# EAGLE design board (EAGLE 9.2.2)
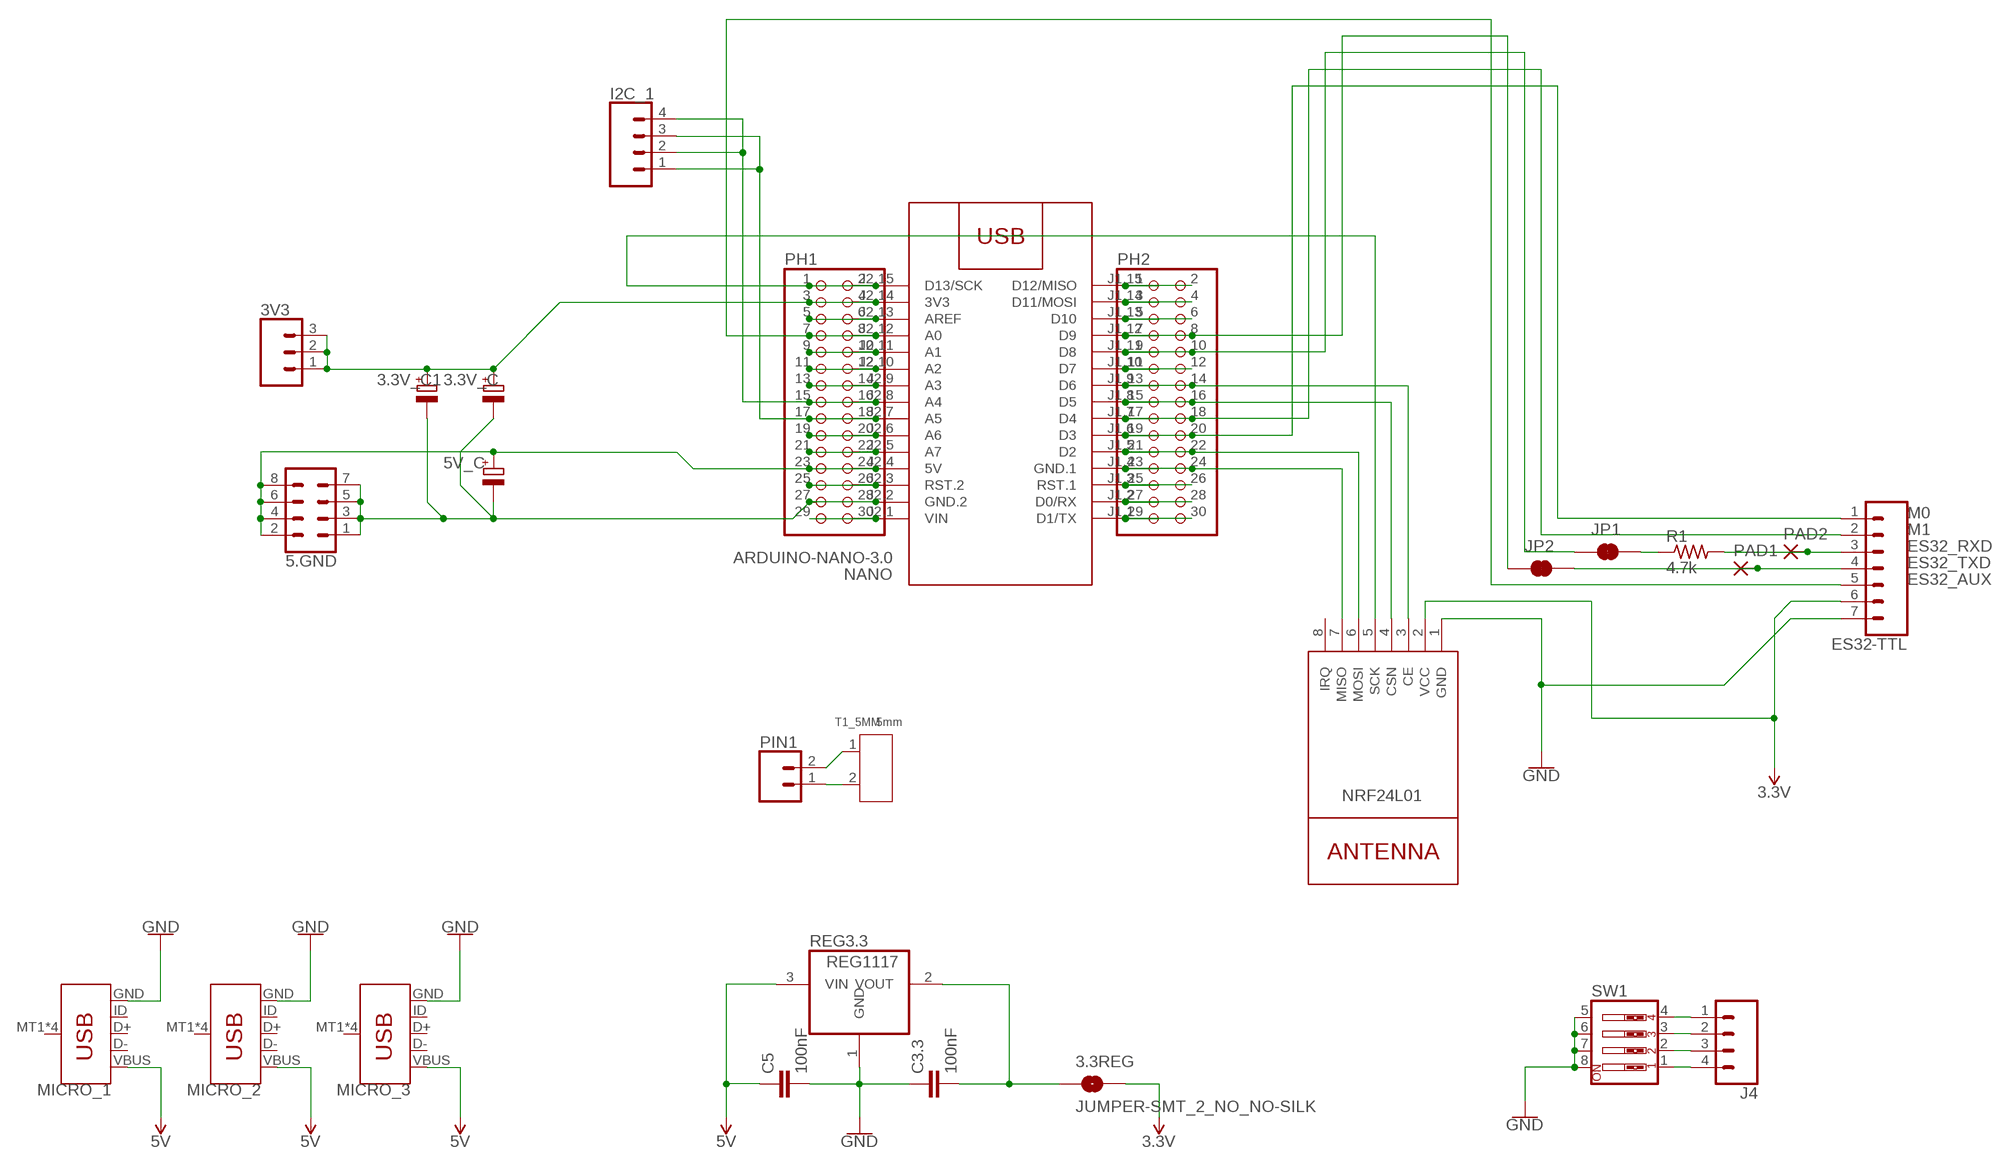
[diagram p0: schematic, sheet 1]

## Parts
3.3REG  JUMPER-SMT_2_NO_NO-SILK  [SMT-JUMPER_2_NO_NO-SILK]
3.3V_C  CPOL-EUD  [PANASONIC_D]
3.3V_C1  CPOL-EUD  [PANASONIC_D]
3V3  CONN_03LOCK  [1X03_LOCK]
5.GND  CONN_04X2  [2X4]
5V_C  CPOL-EUD  [PANASONIC_D]
C3.3  100nF  C-EUC0805  [C0805]
C5  100nF  C-EUC0805  [C0805]
ES32-TTL  CONN_07LOCK  [1X07_LOCK]
I2C_1  CONN_04LOCK  [1X04_LOCK]
J4  CONN_04LOCK  [1X04_LOCK]
JP1  JUMPER-SMT_2_NC_TRACE_SILK  [SMT-JUMPER_2_NC_TRACE_SILK]
JP2  JUMPER-SMT_2_NC_TRACE_SILK  [SMT-JUMPER_2_NC_TRACE_SILK]
MICRO_1  USB_MICRO-B_SMT  [USB-MICROB]
MICRO_2  USB_MICRO-B_SMT  [USB-MICROB]
MICRO_3  USB_MICRO-B_SMT  [USB-MICROB]
NANO  ARDUINO-NANO-3.0  [ARDUINO-NANO-3.0]
NRF24L01  WIRELESS-NRF24L01  [WIRELESS-NRF24L01]
PAD1  1,6/0,8  [1,6/0,8]
PAD2  1,6/0,8  [1,6/0,8]
PH1  PINHD-2X15  [2X15]
PH2  PINHD-2X15  [2X15]
PIN1  CONN_02LOCK  [1X02_LOCK]
R1  4.7k  R-US_R2012  [R2012]
REG3.3  REG1117  [SOT223]
SW1  SW_DIP-4  [EDG-04]
T1_5MM  5mm  SCREW-TERMINAL-GREEN(2P-5.0)  [H2-5.0-10.5X8.0MM]

## Nets
3.3V [power]: 3.3REG.2 3.3V_C1.+ 3.3V_C.+ 3V3.1 3V3.2 3V3.3 ES32-TTL.6 NANO.J2.14(3V3) NRF24L01.2(VCC) PH1.3 PH1.4
5V [power]: 5.GND.2 5.GND.4 5.GND.6 5.GND.8 5V_C.+ C5.1 MICRO_1.VBUS MICRO_2.VBUS MICRO_3.VBUS NANO.J2.4(5V) PH1.23 PH1.24 REG3.3.3(VIN)
A6: NANO.J2.6(A6) PH1.19 PH1.20
A7: NANO.J2.5(A7) PH1.21 PH1.22
CE_NRF: NANO.J1.9(D6) NRF24L01.3(CE) PH2.13 PH2.14
CSN_NRF: NANO.J1.8(D5) NRF24L01.4(CSN) PH2.15 PH2.16
ES32_AUX: ES32-TTL.5 NANO.J2.12(A0) PH1.7 PH1.8
ES32_RXD: ES32-TTL.3 PAD2.1(P) R1.2
ES32_TXD: JP2.1 NANO.J1.12(D9) PH2.7 PH2.8
GND [power]: 3.3V_C1.- 3.3V_C.- 5.GND.1 5.GND.3 5.GND.5 5.GND.7 5V_C.- C3.3.1 C5.2 ES32-TTL.7 MICRO_1.GND MICRO_2.GND MICRO_3.GND NANO.J2.2(GND.2) NRF24L01.1(GND) PH1.27 PH1.28 REG3.3.1(GND) SW1.5 SW1.6 SW1.7 SW1.8
M0: ES32-TTL.1 NANO.J1.6(D3) PH2.19 PH2.20
M1: ES32-TTL.2 NANO.J1.7(D4) PH2.17 PH2.18
MISO_NRF: NANO.J1.4(GND.1) NRF24L01.7(MISO) PH2.23 PH2.24
MOSI_NRF: NANO.J1.5(D2) NRF24L01.6(MOSI) PH2.21 PH2.22
N$1: NANO.J1.14(D11/MOSI) PH2.3 PH2.4
N$2 [power]: 3.3REG.1 C3.3.2 REG3.3.2(VOUT)
N$3: NANO.J2.13(AREF) PH1.5 PH1.6
N$4: NANO.J1.13(D10) PH2.5 PH2.6
N$5: NANO.J2.11(A1) PH1.9 PH1.10
N$6: NANO.J2.10(A2) PH1.11 PH1.12
N$7: NANO.J2.9(A3) PH1.13 PH1.14
N$8: JP1.2 R1.1
N$9: ES32-TTL.4 JP2.2 PAD1.1(P)
N$16: NANO.J1.15(D12/MISO) PH2.1 PH2.2
N$17: JP1.1 NANO.J1.11(D8) PH2.9 PH2.10
N$21: NANO.J1.10(D7) PH2.11 PH2.12
N$23 [terminal]: PIN1.2 T1_5MM.1
N$26 [terminal]: PIN1.1 T1_5MM.2
N$28: NANO.J1.3(RST.1) PH2.25 PH2.26
N$29: NANO.J1.2(D0/RX) PH2.27 PH2.28
N$30: NANO.J1.1(D1/TX) PH2.29 PH2.30
N$39 [power]: J4.1 SW1.4
N$40 [power]: J4.2 SW1.3
N$41 [power]: J4.3 SW1.2
N$42 [power]: J4.4 SW1.1
RST: NANO.J2.3(RST.2) PH1.25 PH1.26
SCK_NRF: NANO.J2.15(D13/SCK) NRF24L01.5(SCK) PH1.1 PH1.2
SCL: I2C_1.1 I2C_1.3 NANO.J2.7(A5) PH1.17 PH1.18
SDA: I2C_1.2 I2C_1.4 NANO.J2.8(A4) PH1.15 PH1.16
VIN [power]: NANO.J2.1(VIN) PH1.29 PH1.30
Unconnected: MICRO_1.D+ MICRO_1.D- MICRO_1.ID MICRO_1.MT1(SHIELD) MICRO_1.MT2(SHIELD) MICRO_1.P$1(SHIELD) MICRO_1.P$2(SHIELD) MICRO_2.D+ MICRO_2.D- MICRO_2.ID MICRO_2.MT1(SHIELD) MICRO_2.MT2(SHIELD) MICRO_2.P$1(SHIELD) MICRO_2.P$2(SHIELD) MICRO_3.D+ MICRO_3.D- MICRO_3.ID MICRO_3.MT1(SHIELD) MICRO_3.MT2(SHIELD) MICRO_3.P$1(SHIELD) MICRO_3.P$2(SHIELD) NRF24L01.8(IRQ)

## Library data of the parts
3.3REG = SparkFun-Jumpers:JUMPER-SMT_2_NO: Normally open jumper This jumper has two pads in close proximity to each other. Apply solder to close the connection. Round pads are easier to solder for beginners, but are a lot larger. SparkFun Product that uses the round pads: SparkFun EL Sequencer <https://www.sparkfun.com/products/12781>
3.3V_C 3.3V_C1 5V_C = rcl:CPOL-EU: POLARIZED CAPACITOR, European symbol
3V3 = SparkFun-Connectors:CONN_03: Multi connection point. Often used as Generic Header-pin footprint for 0.1 inch spaced/style header connections On any of the 0.1 inch spaced packages, you can populate with these: Break Away Headers - Straight <https://www.sparkfun.com/products/116> (PRT-00116) Break Away Male Headers - Right Angle <https://www.sparkfun.com/products/553> (PRT-00553) Female Headers <https://www.sparkfun.com/products/115> (PRT-00115) Break Away Headers - Machine Pin <https://www.sparkfun.com/products/117> (PRT-00117) Break Away Female Headers - Swiss Machine Pin <https://www.sparkfun.com/products/743> (PRT-00743) Stackable Header - 3 Pin (Female, 0.1") <https://www.sparkfun.com/products/13875> (PRT-13875) For SCREWTERMINALS and SPRING TERMINALS visit here: Screw Terimnals on SparkFun.com <https://www.sparkfun.com/search/results?term=Screw+Terminals> (5mm/3.5mm/2.54mm spacing) This device is also useful as a general connection point to wire up your design to another part of your project. Our various solder wires solder well into these plated through hole pads. Hook-Up Wire - Assortment (Stranded, 22 AWG) <https://www.sparkfun.com/products/11375> (PRT-11375) Hook-Up Wire - Assortment (Solid Core, 22 AWG) <https://www.sparkfun.com/products/11367> (PRT-11367) View the entire wire category on our website here <https://www.sparkfun.com/categories/141> Special notes: Molex polarized connector foot print use with SKU : PRT-08232 with associated crimp pins and housings.
5.GND = SparkFun-Connectors:CONN_04X2: Multi connection point. Often used as Generic Header-pin footprint for 0.1 inch spaced/style header connections On any of the 0.1 inch spaced packages, you can populate with these: Break Away Headers - Straight <https://www.sparkfun.com/products/116> (PRT-00116) Break Away Male Headers - Right Angle <https://www.sparkfun.com/products/553> (PRT-00553) Female Headers <https://www.sparkfun.com/products/115> (PRT-00115) Break Away Headers - Machine Pin <https://www.sparkfun.com/products/117> (PRT-00117) Break Away Female Headers - Swiss Machine Pin <https://www.sparkfun.com/products/743> (PRT-00743)
C3.3 C5 = rcl:C-EU: CAPACITOR, European symbol; SPICEPREFIX: C
ES32-TTL = SparkFun-Connectors:CONN_07: Multi connection point. Often used as Generic Header-pin footprint for 0.1 inch spaced/style header connections On any of the 0.1 inch spaced packages, you can populate with these: Break Away Headers - Straight <https://www.sparkfun.com/products/116> (PRT-00116) Break Away Male Headers - Right Angle <https://www.sparkfun.com/products/553> (PRT-00553) Female Headers <https://www.sparkfun.com/products/115> (PRT-00115) Break Away Headers - Machine Pin <https://www.sparkfun.com/products/117> (PRT-00117) Break Away Female Headers - Swiss Machine Pin <https://www.sparkfun.com/products/743> (PRT-00743) For SCREWTERMINALS and SPRING TERMINALS visit here: Screw Terimnals on SparkFun.com <https://www.sparkfun.com/search/results?term=Screw+Terminals> (5mm/3.5mm/2.54mm spacing) This device is also useful as a general connection point to wire up your design to another part of your project. Our various solder wires solder well into these plated through hole pads. Hook-Up Wire - Assortment (Stranded, 22 AWG) <https://www.sparkfun.com/products/11375> (PRT-11375) Hook-Up Wire - Assortment (Solid Core, 22 AWG) <https://www.sparkfun.com/products/11367> (PRT-11367) View the entire wire category on our website here <https://www.sparkfun.com/categories/141> Special notes: Molex polarized connector foot print use with SKU : PRT-08231 with associated crimp pins and housings. 1MM SMD Version SKU: PRT-10208 NOTES ON THE VARIANTS LOCK and LOCK_LONGPADS... This footprint was designed to help hold the alignment of a through-hole component (i.e. 6-pin header) while soldering it into place. You may notice that each hole has been shifted either up or down by 0.005 of an inch from it's more standard position (which is a perfectly straight line). This slight alteration caused the pins (the squares in the middle) to touch the edges of the holes. Because they are alternating, it causes a "brace" to hold the component in place. 0.005 has proven to be the perfect amount of "off-center" position when using our standard breakaway headers. Although looks a little odd when you look at the bare footprint, once you have a header in there, the alteration is very hard to notice. Also,if you push a header all the way into place, it is covered up entirely on the bottom side.
I2C_1 J4 = SparkFun-Connectors:CONN_04: Multi connection point. Often used as Generic Header-pin footprint for 0.1 inch spaced/style header connections On any of the 0.1 inch spaced packages, you can populate with these: Break Away Headers - Straight <https://www.sparkfun.com/products/116> (PRT-00116) Break Away Male Headers - Right Angle <https://www.sparkfun.com/products/553> (PRT-00553) Female Headers <https://www.sparkfun.com/products/115> (PRT-00115) Break Away Headers - Machine Pin <https://www.sparkfun.com/products/117> (PRT-00117) Break Away Female Headers - Swiss Machine Pin <https://www.sparkfun.com/products/743> (PRT-00743) For SCREWTERMINALS and SPRING TERMINALS visit here: Screw Terimnals on SparkFun.com <https://www.sparkfun.com/search/results?term=Screw+Terminals> (5mm/3.5mm/2.54mm spacing) This device is also useful as a general connection point to wire up your design to another part of your project. Our various solder wires solder well into these plated through hole pads. Hook-Up Wire - Assortment (Stranded, 22 AWG) <https://www.sparkfun.com/products/11375> (PRT-11375) Hook-Up Wire - Assortment (Solid Core, 22 AWG) <https://www.sparkfun.com/products/11367> (PRT-11367) View the entire wire category on our website here <https://www.sparkfun.com/categories/141> Special notes: Molex polarized connector foot print use with SKU : PRT-08231 with associated crimp pins and housings. 1MM SMD Version SKU: PRT-10208; PROD_ID: CONN-09696
JP1 JP2 = SparkFun-Jumpers:JUMPER-SMT_2_NC_TRACE: Normally closed trace jumper This jumper has a trace between two pads so it's normally closed (NC). Use a razor knife to open the connection. For best results follow the IPC guidelines for cutting traces: Cutout at least 0.063 mm (0.005 in). Remove all loose material to clean up the cut area. Seal the cut with an approved epoxy. Reapply solder to reclose the connection.
MICRO_1-MICRO_3 = SparkFun-Connectors:USB_MICRO-B: USB Type Micro-B Connector Male/female and PTH/SMT variants SparkFun Products: SparkFun microB USB Breakout <https://www.sparkfun.com/products/12035> SparkFun USB microB Plug Breakout <https://www.sparkfun.com/products/10031> SparkFun ESP8266 Thing <https://www.sparkfun.com/products/13231>; PROD_ID: CONN-09505; SF_ID: PRT-08533
NANO = diy-modules:ARDUINO-NANO-3.0: Arduino Nano 3.0 and compatible devices More details available here: https://www.arduino.cc/en/Main/ArduinoBoardNano Click here to find device on ebay.com <http://www.ebay.com/sch/arduino+nano>
NRF24L01 = diy-modules:WIRELESS-NRF24L01: 2.4 GHz Wireless Module based on NRF24L01 chip More details available here: http://www.electrodragon.com/w/NRF24L01 Click here to find device on ebay.com <http://www.ebay.com/sch/nrf24l01+arduino>
PAD1 PAD2 = wirepad:1,6/0,8: THROUGH-HOLE PAD
PH1 PH2 = pinhead:PINHD-2X15: PIN HEADER
PIN1 = SparkFun-Connectors:CONN_02: Multi connection point. Often used as Generic Header-pin footprint for 0.1 inch spaced/style header connections On any of the 0.1 inch spaced packages, you can populate with these: Break Away Headers - Straight <https://www.sparkfun.com/products/116> (PRT-00116) Break Away Male Headers - Right Angle <https://www.sparkfun.com/products/553> (PRT-00553) Female Headers <https://www.sparkfun.com/products/115> (PRT-00115) Break Away Headers - Machine Pin <https://www.sparkfun.com/products/117> (PRT-00117) Break Away Female Headers - Swiss Machine Pin <https://www.sparkfun.com/products/743> (PRT-00743) For SCREWTERMINALS and SPRING TERMINALS visit here: Screw Terimnals on SparkFun.com <https://www.sparkfun.com/search/results?term=Screw+Terminals> (5mm/3.5mm/2.54mm spacing) This device is also useful as a general connection point to wire up your design to another part of your project. Our various solder wires solder well into these plated through hole pads. Hook-Up Wire - Assortment (Stranded, 22 AWG) <https://www.sparkfun.com/products/11375> (PRT-11375) Hook-Up Wire - Assortment (Solid Core, 22 AWG) <https://www.sparkfun.com/products/11367> (PRT-11367) View the entire wire category on our website here <https://www.sparkfun.com/categories/141> Special notes: Molex polarized connector foot print use with: PRT-08233 with associated crimp pins and housings. 2.54_SCREWTERM for use with PRT-10571. 3.5mm Screw Terminal footprints for PRT-08084 5mm Screw Terminal footprints for use with PRT-08432
R1 = rcl:R-US_: RESISTOR, American symbol; SPICEPREFIX: R
REG3.3 = burr-brown:REG1117: 800mA and 1A Low Dropout (LDO) Positive Regulator 1.8V, 2.5V, 2.85V, 3.3V, 5V, and Adj; MPN: REG1117; OC_FARNELL: 1097566; OC_NEWARK: 14P6981
SW1 = special:SW_DIP-4: DIP SWITCH
T1_5MM = Seeed-Connector:SCREW-TERMINAL-GREEN(2P-5.0): 320110031; VALUE: GREEN-2P-5.0

## Net classes
0 default: width 0.203 mm
1 power: width 0.762 mm, clearance 0.254 mm
2 terminal: width 2.159 mm, clearance 0.305 mm

## Board
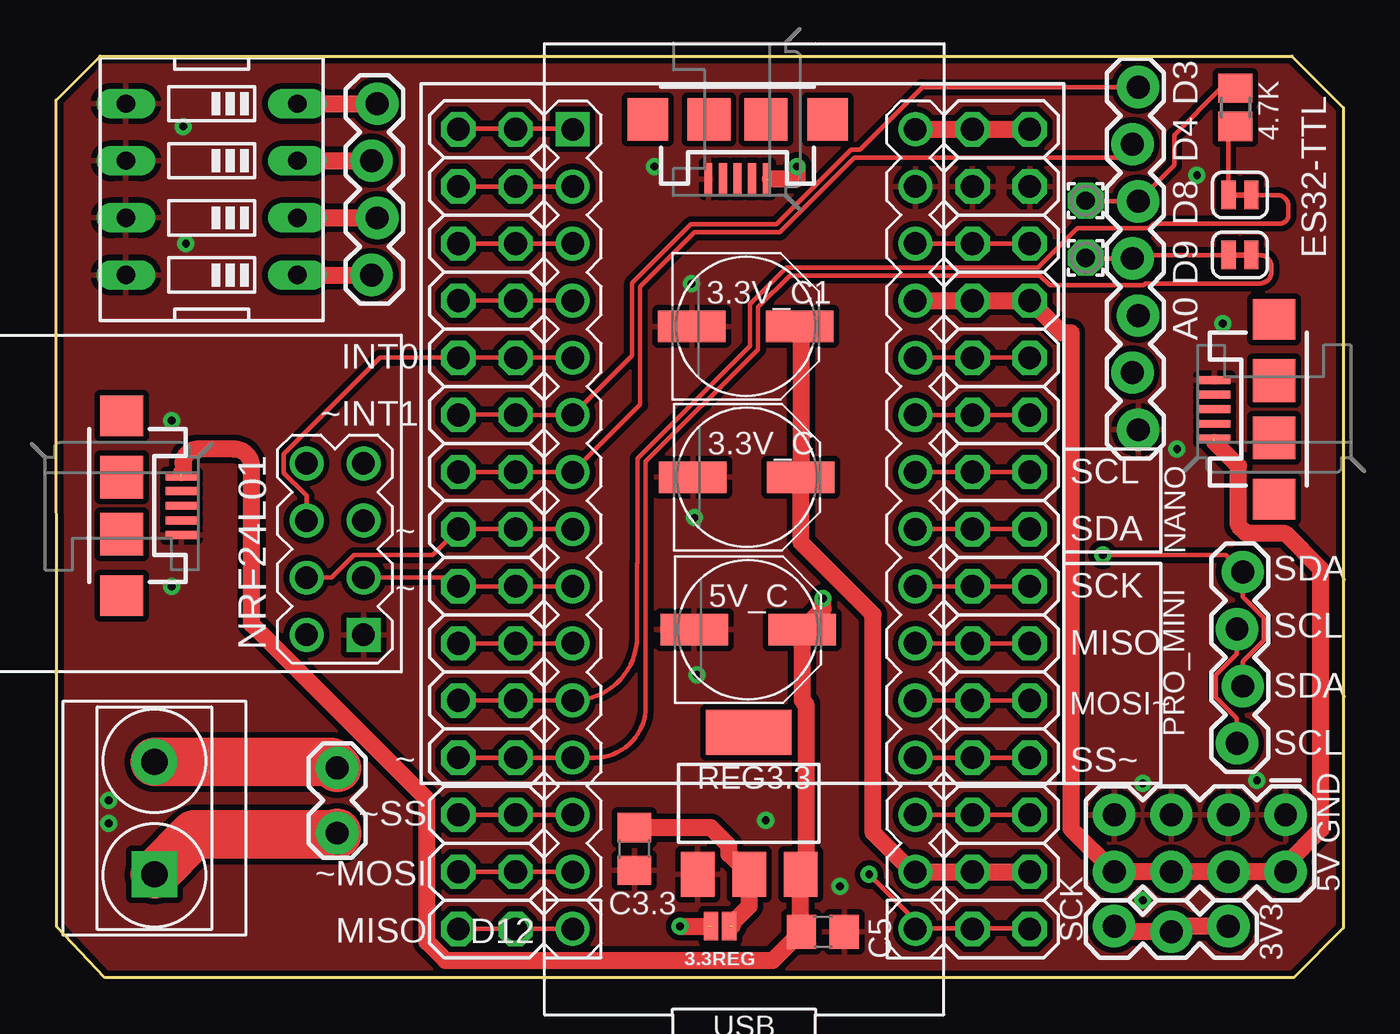
[diagram p1: board, top side]
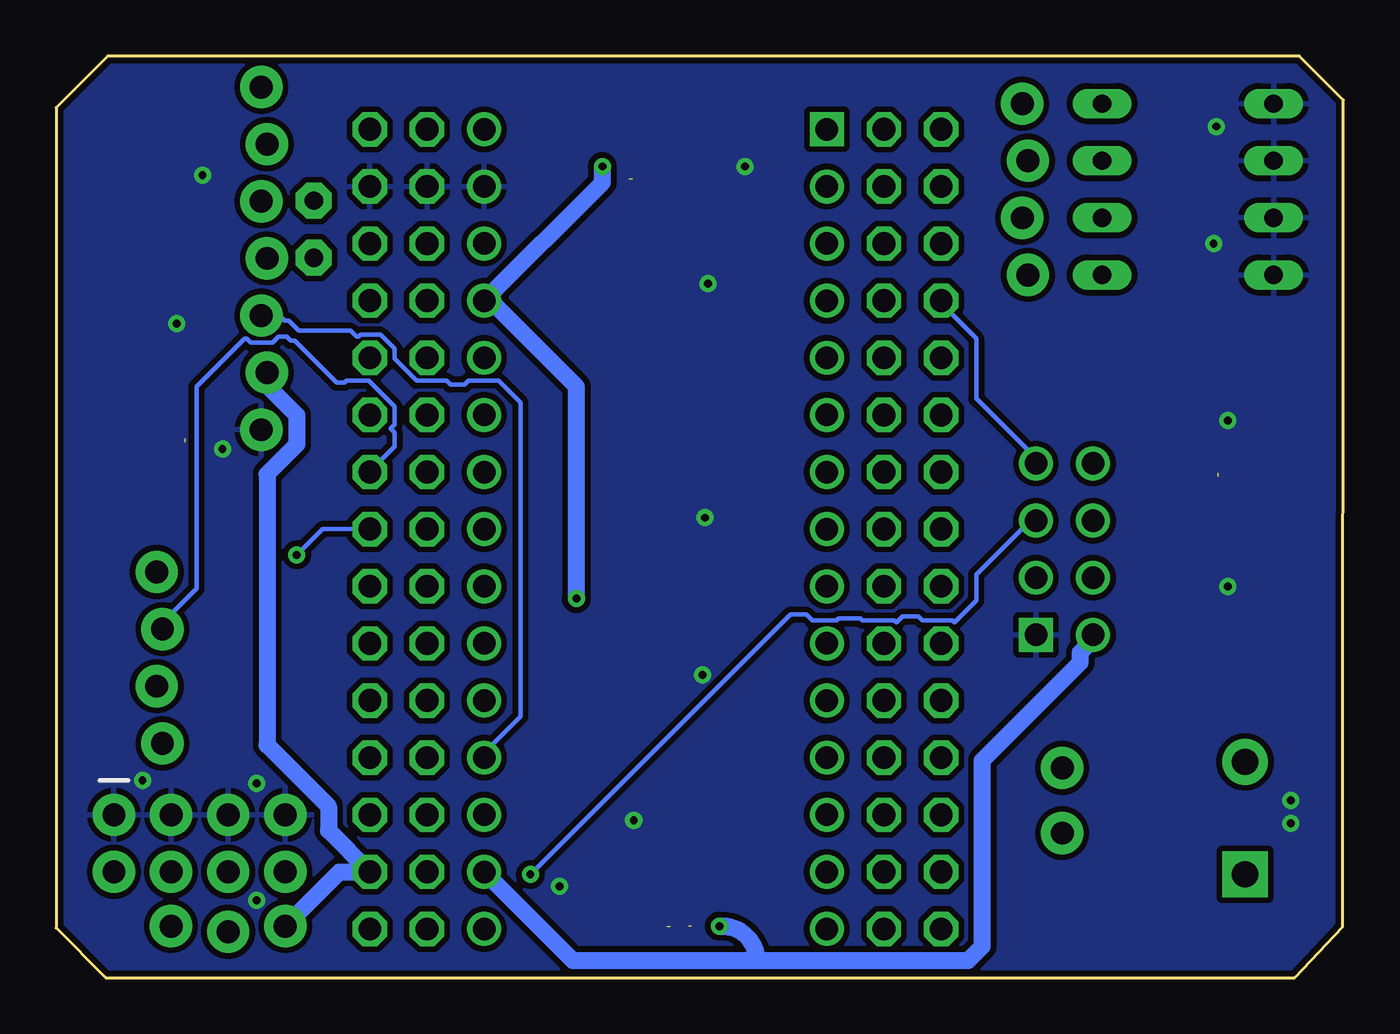
[diagram p2: board, bottom side, seen from below]

Size 57.23 x 40.97 mm. Coordinates in mm from the lower left corner, seen from the top.
Outline: 1.96,40.97 54.94,40.97 57.23,38.68 57.23,2.21 55.02,0 2.16,0 0.03,2.26 0,39.01 1.96,40.97
Copper layers (1*16): Top 0.035mm / dielectric 1.5mm / Bottom 0.035mm
Design rules "default *": minimum track width 6mil, minimum drill 0.35mm, track to track 6mil, track to pad 6mil, pad to pad 6mil, via to via 6mil, smd to smd 6mil, copper to edge 10mil, drill to drill 6mil, minimum pad ring 10mil, minimum via ring 8mil, stop-mask expansion 4mil, vias tented up to drill 0mil, thermal gap 10mil

### Footprints (pad centres in the part's own frame; a part is rotated, then mirrored left to right if it is on the bottom)
SMT-JUMPER_2_NO_NO-SILK = smd 0.635 x 1.27: 1 -0.406,0; 2 0.406,0
PANASONIC_D = smd 3 x 1.4: + 2.4,0; - -2.4,0
1X03_LOCK = drill 1.016 pad 1.88: 1 0,0.127; 2 2.54,-0.127; 3 5.08,0.127
2X4 = drill 1.016 pad 1.88: 1 -3.81,-1.27; 2 -3.81,1.27; 3 -1.27,-1.27; 4 -1.27,1.27; 5 1.27,-1.27; 6 1.27,1.27; 7 3.81,-1.27; 8 3.81,1.27
C0805 = smd 1.3 x 1.5: 1 -0.95,0; 2 0.95,0
1X07_LOCK = drill 1.016 pad 1.88: 1 0,0.127; 2 2.54,-0.127; 3 5.08,0.127; 4 7.62,-0.127; 5 10.16,0.127; 6 12.7,-0.127; 7 15.24,0.127
1X04_LOCK = drill 1.016 pad 1.88: 1 0,0.127; 2 2.54,-0.127; 3 5.08,0.127; 4 7.62,-0.127
SMT-JUMPER_2_NC_TRACE_SILK = smd 0.635 x 1.27: 1 -0.508,0; 2 0.508,0
USB-MICROB = smd 1.4 x 0.35: D+ -2.65,0; D- -2.65,-0.65; GND -2.65,1.3; ID -2.65,0.65; VBUS -2.65,-1.3 | smd 1.9 x 1.8: MT1 0,-4; MT2 0,4 | smd 1.9 x 1.9: P$1 0,-1.27; P$2 0,1.27
ARDUINO-NANO-3.0 = drill 1 square: J1.1 17.78,7.62 | drill 1: J1.2 15.24,7.62; J1.3 12.7,7.62; J1.4 10.16,7.62; J1.5 7.62,7.62; J1.6 5.08,7.62; J1.7 2.54,7.62; J1.8 0,7.62; J1.9 -2.54,7.62; J1.10 -5.08,7.62; J1.11 -7.62,7.62; J1.12 -10.16,7.62; J1.13 -12.7,7.62; J1.14 -15.24,7.62; J1.15 -17.78,7.62; J2.1 17.78,-7.62; J2.2 15.24,-7.62; J2.3 12.7,-7.62; J2.4 10.16,-7.62; J2.5 7.62,-7.62; J2.6 5.08,-7.62; J2.7 2.54,-7.62; J2.8 0,-7.62; J2.9 -2.54,-7.62; J2.10 -5.08,-7.62; J2.11 -7.62,-7.62; J2.12 -10.16,-7.62; J2.13 -12.7,-7.62; J2.14 -15.24,-7.62; J2.15 -17.78,-7.62
WIRELESS-NRF24L01 = drill 1 square: 1 -12.7,6.35 | drill 1: 2 -10.16,6.35; 3 -12.7,3.81; 4 -10.16,3.81; 5 -12.7,1.27; 6 -10.16,1.27; 7 -12.7,-1.27; 8 -10.16,-1.27
1,6/0,8 = drill 0.813 pad 1.6 octagon: 1 0,0
2X15 = drill 1.016 octagon: 1 -17.78,-1.27; 2 -17.78,1.27; 3 -15.24,-1.27; 4 -15.24,1.27; 5 -12.7,-1.27; 6 -12.7,1.27; 7 -10.16,-1.27; 8 -10.16,1.27; 9 -7.62,-1.27; 10 -7.62,1.27; 11 -5.08,-1.27; 12 -5.08,1.27; 13 -2.54,-1.27; 14 -2.54,1.27; 15 0,-1.27; 16 0,1.27; 17 2.54,-1.27; 18 2.54,1.27; 19 5.08,-1.27; 20 5.08,1.27; 21 7.62,-1.27; 22 7.62,1.27; 23 10.16,-1.27; 24 10.16,1.27; 25 12.7,-1.27; 26 12.7,1.27; 27 15.24,-1.27; 28 15.24,1.27; 29 17.78,-1.27; 30 17.78,1.27
1X02_LOCK = drill 1.016 pad 1.88: 1 -0.178,0; 2 2.718,0
R2012 = smd 1.3 x 1.5: 1 -0.85,0; 2 0.85,0
SOT223 = smd 1.499 x 2.007: 1 -2.261,-3.15; 2 0.025,-3.15; 3 2.311,-3.15 | smd 3.81 x 2.007: 4 0,3.15
EDG-04 = drill 0.813 long: 1 -3.81,-3.81; 2 -1.27,-3.81; 3 1.27,-3.81; 4 3.81,-3.81; 5 3.81,3.81; 6 1.27,3.81; 7 -1.27,3.81; 8 -3.81,3.81
H2-5.0-10.5X8.0MM = drill 1.168 pad 2.032 square: 1 0,2.5 | drill 1.168 pad 2.032: 2 0,-2.5

### Placement (x,y rotation side)
3.3REG  29.51,2.29 180 top
3.3V_C  30.71,22.25 0 top
3.3V_C1  30.66,28.96 0 top
3V3  47.04,2.16 0 top
5.GND  50.85,5.97 180 top
5V_C  30.76,15.47 0 top
C3.3  25.7,5.71 90 top
C5  34.09,2.03 0 top
ES32-TTL  47.98,39.6 270 top
I2C_1  52.63,10.41 90 top
J4  14.15,38.86 270 top
JP1  52.63,34.8 180 top
JP2  52.63,32.13 180 top
MICRO_1  2.92,20.98 180 top
MICRO_2  30.29,38.16 90 top
MICRO_3  54.15,25.27 0 top
NANO  30.58,19.94 90 top
NRF24L01  0.97,21.59 180 top
PAD1  45.77,32 0 top
PAD2  45.77,34.54 0 top
PH1  42.01,19.94 90 top
PH2  19.15,19.94 90 top
PIN1  12.5,9.14 270 top
R1  52.43,38.7 90 top
REG3.3  30.78,7.75 0 top
SW1  6.91,35.05 90 top
T1_5MM  4.37,7.09 180 top

### Tracks (layer width: path | path; a pad name or v marks a point on that pad's centre or on a via)
3.3V  (via drill 0.35)  (1 unrouted)
  Top 0.762: 3.3V_C1.+ 33.12,28.94 33.12,22.28 3.3V_C.+ 33.12,21.92 33.12,19.34 36.32,16.14 36.32,6.45 38.01,4.76 38.19,4.76 NANO.J2.14 PH1.4 PH1.3 | 3V3.3 49.83,2.29 3V3.2 47.29,2.03 3V3.1 | v27.74,2.29 28.97,2.29
  Bottom 0.762: NRF24L01.2 11.16,15.16 11.16,14.99 11.7,14.45 11.7,14.01 16.05,9.65 16.05,1.38 16.67,0.76 26.09,0.76 | ES32-TTL.6 47.85,26.33 46.53,25.01 46.53,23.71 47.85,22.39 47.85,10.34 45.12,7.61 45.12,6.54 PH1.3 44.63,4.7 3V3.1 | NANO.J2.14 34.26,0.76 26.09,0.76 | v27.74,2.29 27.61,2.29 arc90 26.09,0.76
5V  (via drill 0.35)  (3 unrouted)
  Top 0.762: NANO.J2.4 PH1.24 PH1.23 44.7,28.68 45.12,28.68 45.12,6.62 5.GND.8 5.GND.6 5.GND.4 5.GND.2 54.66,5.01 56.24,6.59 56.24,18.16 54.66,19.74 52.94,19.74 52.57,20.11 52.57,22.75 51.5,23.81 | v32.94,36.07 32.94,35.51 31.75,35.51 | v34.1,16.85 34.1,16.41 5V_C.+ 33.16,12.33 33.32,12.16 33.32,4.83 REG3.3.3 33.1,2.07 C5.1 31.87,0.76 17.3,0.76 16.48,1.58 16.48,7.92 8.69,15.71 8.69,22.73 arc90 7.92,23.5 6.27,23.5 arc90 5.64,22.86 5.64,22.51 5.57,22.44
  Bottom 0.762: v34.1,16.85 34.1,26.28 37.92,30.1 NANO.J2.4 32.94,35.36 v32.94,36.07
A6
  Top 0.203: PH1.19 PH1.20 NANO.J2.6
A7
  Top 0.203: NANO.J2.5 PH1.22 PH1.21
CE_NRF
  Top 0.203: NANO.J1.9 PH2.13 PH2.14 17.5,17.78 NRF24L01.3
CSN_NRF
  Top 0.203: NRF24L01.4 12.24,17.78 13.25,18.79 16.73,18.79 PH2.16 PH2.15 NANO.J1.8
ES32_AUX
  Top 0.203: NANO.J2.12 PH1.8 PH1.7
  Bottom 0.203: ES32-TTL.5 48.06,29.39 47.26,29.39 47.08,29.21 46.9,29.21 46.46,28.77 44.14,28.77 43.88,28.5 43.79,28.5 43.7,28.59 42.81,28.59 42.19,27.96 42.19,27.52 41.21,26.54 39.88,26.54 39.7,26.37 39.08,26.37 38.9,26.54 37.57,26.54 36.59,25.57 36.59,11.61 38.19,10.01 38.19,9.83 NANO.J2.12
ES32_RXD
  Top 0.203: PAD2.1 45.8,34.52 ES32-TTL.3 49.71,36.12 49.71,37.46 51.79,39.55 R1.2
ES32_TXD
  Top 0.203: PH2.8 PH2.7 NANO.J1.12 23.93,9.78 arc90 26.21,12.06 26.21,22.94 31.2,27.93 31.2,29.8 32.62,31.22 43.74,31.22 44.18,30.79 48.35,30.79 48.42,30.86 53.52,30.86 arc90 54.03,31.37 54.03,31.62 arc90 53.52,32.13 JP2.1
GND  (via drill 0.35)
  other vias: 48.31,3.43 2.34,7.87 2.34,6.86 34.85,4.06 5.13,17.4 5.13,24.77 51.87,29.08 50.72,35.69 5.64,37.85 5.77,32.64 28.24,30.86 26.59,36.07 28.5,13.46 28.37,20.45 31.55,6.99 53.39,8.76 48.31,8.64 49.83,23.5
  pour Top: -30.18,60.68 -30.18,-27.81 79.55,-27.81 79.55,60.68
  pour Bottom: -30.43,-28.07 80.31,-28.07 80.31,60.83 -30.43,60.83
M0
  Top 0.203: 20.5,25.03 PH2.19 | PH2.20 17.92,25.03 20.32,25.03 PH2.19 | PH2.19 NANO.J1.6 25.6,27.66 25.6,30.88 28.22,33.5 32.03,33.5 35.34,36.8 35.74,36.8 37.09,38.16 37.09,38.18 38.51,39.6 ES32-TTL.1
M1
  Top 0.203: PH2.18 PH2.17 NANO.J1.7 25.96,25.48 25.96,30.73 28.37,33.15 32.18,33.15 35.48,36.45 47.24,36.45 ES32-TTL.2
MISO_NRF
  Top 0.203: PH2.24 PH2.23 NANO.J1.4
  Bottom 0.203: NRF24L01.7 13.74,22.9 13.74,23.17 16.32,25.74 16.32,28.41 17.83,29.92 17.83,30.1 PH2.24
MOSI_NRF
  Top 0.203: NRF24L01.6 11.12,21.43 10.12,22.44 10.12,23.28 14.4,27.56 PH2.22 PH2.21 NANO.J1.5
N$1
  Top 0.203: NANO.J1.14 PH2.3 PH2.4
N$2  (1 unrouted)
  Top 0.762: C3.3.2 29.11,6.67 29.91,5.86 29.91,5.5 REG3.3.2 30.81,3.17 30.06,2.43 30.06,2.29
N$3
  Top 0.203: NANO.J2.13 PH1.6 PH1.5
N$4
  Top 0.203: PH2.6 PH2.5 NANO.J1.13
N$5
  Top 0.203: PH1.9 PH1.10 NANO.J2.11
N$6
  Top 0.203: NANO.J2.10 PH1.12 PH1.11
N$7
  Top 0.203: NANO.J2.9 38.28,17.39 40.68,17.39 PH1.14 40.77,17.39 43.26,17.39 PH1.13
N$8
  Top 0.203: JP1.2 52.12,37.85 R1.1
N$9
  Top 0.203: PAD1.1 45.77,31.98 ES32-TTL.4 48.01,32.13 JP2.2
N$16
  Top 0.203: PH2.2 PH2.1 NANO.J1.15
N$17
  Top 0.203: PH2.10 PH2.9 NANO.J1.11 arc90 25.83,15.19 25.83,18.42 25.86,18.44 25.86,23.09 30.85,28.08 30.85,29.95 32.47,31.57 43.65,31.57 45.4,33.32 48.6,33.32 48.8,33.53 54.41,33.53 arc90 54.79,33.91 54.79,34.29 arc90 54.28,34.8 JP1.1
N$21
  Top 0.203: PH2.12 PH2.11 NANO.J1.10
N$23
  Top 2.159: PIN1.2 12.5,6.36 6.14,6.36 T1_5MM.1
N$26
  Top 2.159: T1_5MM.2 12.23,9.59 PIN1.1
N$28
  Top 0.203: PH2.26 PH2.25 NANO.J1.3
N$29
  Top 0.203: NANO.J1.2 PH2.27 PH2.28
N$30
  Top 0.203: NANO.J1.1 22.9,37.74 20.5,37.74 PH2.29 20.41,37.74 17.92,37.74 PH2.30
N$39
  Top 0.762: SW1.4 J4.1
N$40
  Top 0.762: SW1.3 J4.2
N$41
  Top 0.762: SW1.2 J4.3
N$42
  Top 0.762: SW1.1 J4.4
RST
  Top 0.203: NANO.J2.3 PH1.26 PH1.25
SCK_NRF  (via drill 0.35)
  Top 0.203: PH1.1 43.26,2.18 40.77,2.18 PH1.2 40.68,2.18 38.28,2.18 NANO.J2.15 38.19,2.18 38.19,2.54 v36.14,4.58
  Bottom 0.203: NRF24L01.5 13.92,20.32 16.32,17.92 16.32,16.76 17.3,15.79 17.39,15.87 18.72,15.87 18.9,16.05 19.61,16.05 19.88,15.79 19.96,15.87 21.39,15.87 21.48,15.96 22.45,15.96 22.54,15.87 23.61,15.87 23.88,16.14 24.59,16.14 v36.14,4.58
SCL
  Top 0.203: NANO.J2.7 PH1.18 PH1.17 | I2C_1.3 52.5,14.39 51.56,13.45 51.56,12.46 52.5,11.52 I2C_1.1
  Bottom 0.203: I2C_1.3 52.5,15.79 50.99,17.3 50.99,26.28 48.86,28.41 48.77,28.41 48.59,28.23 47.61,28.23 47.35,28.5 46.99,28.5 46.81,28.32 46.63,28.32 44.77,26.45 44.41,26.45 44.32,26.54 43.34,26.54 42.19,25.39 42.19,24.59 42.37,24.41 42.19,24.23 42.19,23.61 43.26,22.54 PH1.17
SDA  (via drill 0.35)
  Top 0.203: PH1.15 PH1.16 NANO.J2.8 | I2C_1.2 52.76,14.06 53.7,15 53.7,15.99 52.76,16.93 I2C_1.4 51.99,18.8 v46.53,18.8
  Bottom 0.203: PH1.15 45.39,19.94 v46.53,18.8
VIN
  Top 0.762: NANO.J2.1 PH1.30 PH1.29

### Text on the board
tPlace: D3 | D4 | 4.7K | D8 | D9 | A0 | INT0 | ~INT1 | SCL | ~ | SDA | NANO | ~ | SDA | SCK | SCL | MISO | SDA | MOSI~ | PRO_MINI | ~ | SCL | SS~ | ~SS | GND | ~MOSI | 5V | MISO | D12 | SCK
silktop: TOP
silkbottom: BOT